# EAGLE design z80 (EAGLE 8.2.2)
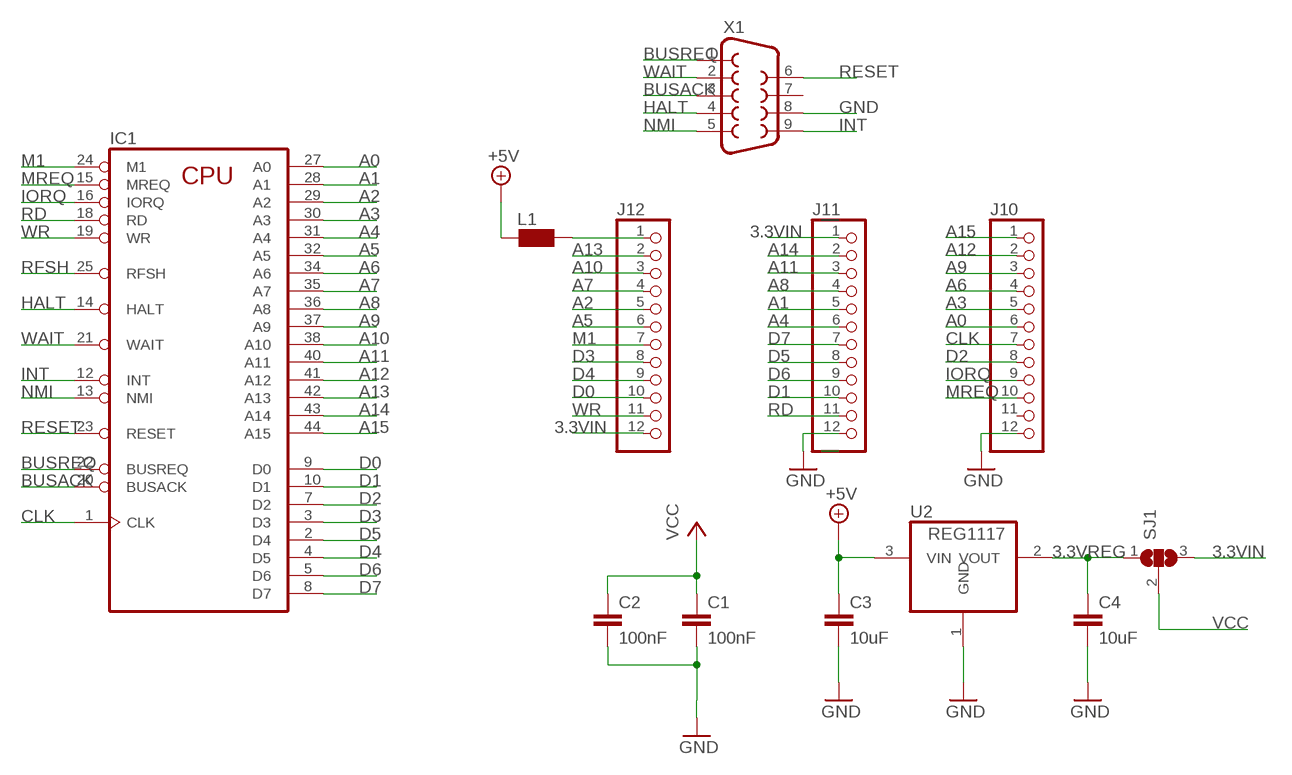
[diagram p0: schematic, sheet 1]

## Parts
C1  100nF  C-EUC0805K  [C0805K]
C2  100nF  C-EUC0805K  [C0805K]
C3  10uF  C-EUC0805K  [C0805K]
C4  10uF  C-EUC0805K  [C0805K]
IC1  Z80CPU-F  [QFP-44]
J10  PINHD-1X12  [1X12]
J11  PINHD-1X12  [1X12]
J12  PINHD-1X12  [1X12]
L1  WE-CBF_0805  [0805]
SJ1  SJ2W  [SJ_2]
U2  REG1117  [SOT223]
X1  F09D  [F09D]

## Nets
3.3VIN [power]: J11.1 J12.12 SJ1.3
3.3VREG [power]: C4.1 SJ1.1 U2.2(VOUT)
+5V [power]: C3.1 L1.2 U2.3(VIN)
A0: IC1.27(A0) J10.6
A1: IC1.28(A1) J11.5
A2: IC1.29(A2) J12.5
A3: IC1.30(A3) J10.5
A4: IC1.31(A4) J11.6
A5: IC1.32(A5) J12.6
A6: IC1.34(A6) J10.4
A7: IC1.35(A7) J12.4
A8: IC1.36(A8) J11.4
A9: IC1.37(A9) J10.3
A10: IC1.38(A10) J12.3
A11: IC1.40(A11) J11.3
A12: IC1.41(A12) J10.2
A13: IC1.42(A13) J12.2
A14: IC1.43(A14) J11.2
A15: IC1.44(A15) J10.1
BUSACK: IC1.20(BUSACK) X1.3
BUSREQ: IC1.22(BUSREQ) X1.1
CLK: IC1.1(CLK) J10.7
D0: IC1.9(D0) J12.10
D1: IC1.10(D1) J11.10
D2: IC1.7(D2) J10.8
D3: IC1.3(D3) J12.8
D4: IC1.4(D5) J12.9
D5: IC1.2(D4) J11.8
D6: IC1.5(D6) J11.9
D7: IC1.8(D7) J11.7
GND [power]: C1.2 C2.2 C3.2 C4.2 J10.12 J11.12 U2.1(GND) X1.8
HALT: IC1.14(HALT) X1.4
INT: IC1.12(INT) X1.9
IORQ: IC1.16(IORQ) J10.9
M1: IC1.24(M1) J12.7
MREQ: IC1.15(MREQ) J10.10
N$1 [power]: J12.1 L1.1
NMI: IC1.13(NMI) X1.5
RD: IC1.18(RD) J11.11
RESET: IC1.23(RESET) X1.6
RFSH: IC1.25(RFSH)
VCC [power]: C1.1 C2.1 SJ1.2
WAIT: IC1.21(WAIT) X1.2
WR: IC1.19(WR) J12.11
Unconnected: IC1.11(NC) IC1.17(NC) IC1.33(NC) IC1.39(NC) J10.11 X1.7

## Power pins joined to a net without a drawn wire
GND: IC1.26(GND)
VCC: IC1.6(VCC)

## Library data of the parts
C1-C4 = rcl:C-EU: CAPACITOR, European symbol
IC1 = Z80FAMIL:Z80CPU-F
J10-J12 = pinhead:PINHD-1X12: PIN HEADER
L1 = wuerth-elektronik:WE-CBF: SMD EMI Suppression Ferrite Beads - excellent anti-EMI properties - low DCR - impedances till 3000 ohms - rated current up to 6 A
SJ1 = jumper:SJ2W: SMD solder JUMPER
U2 = burr-brown:REG1117: 800mA and 1A Low Dropout (LDO) Positive Regulator 1.8V, 2.5V, 2.85V, 3.3V, 5V, and Adj
X1 = con-subd:F09: SUB-D; OC_FARNELL: unknown; OC_NEWARK: unknown

## Net classes
0 default: width 0.203 mm, clearance 0.203 mm
1 power: width 0.406 mm, clearance 0.203 mm to class 0, clearance 0.203 mm

## Board
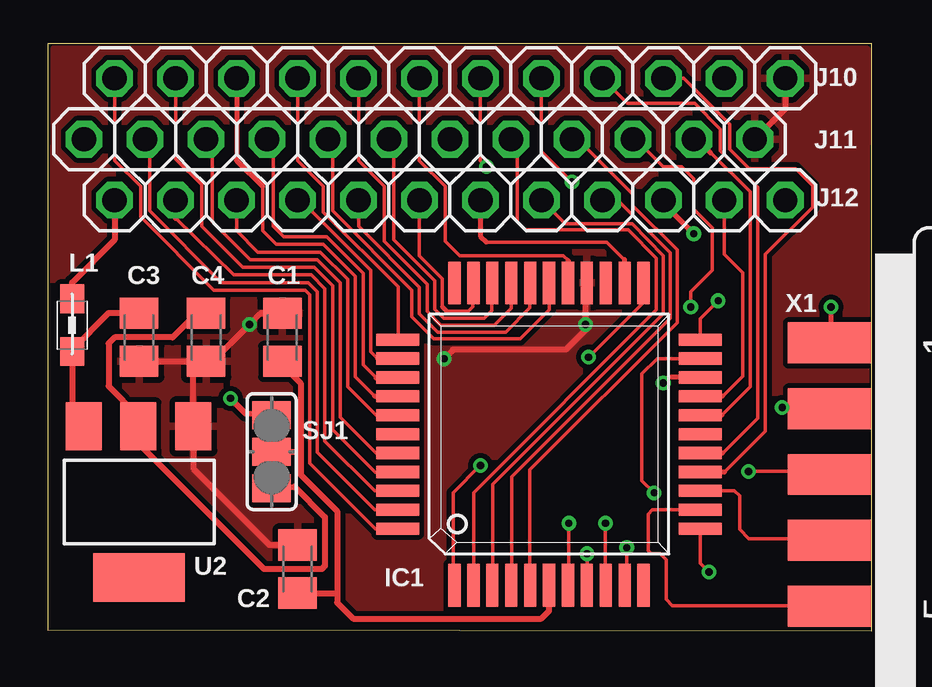
[diagram p1: board, top side]
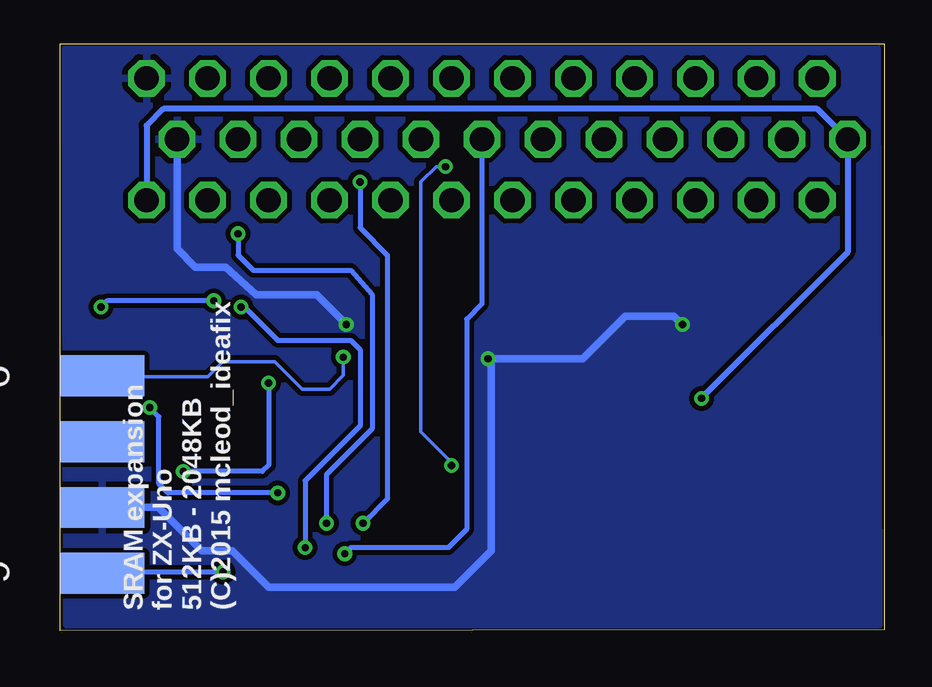
[diagram p2: board, bottom side, seen from below]

No outline drawn. Coordinates in mm, seen from the top.
Copper layers (1*16): Top 0.035mm / dielectric 1.5mm / Bottom 0.035mm
Design rules "dirt_cheap_dirty_boards.v1 *": minimum track width 6mil, minimum drill 12mil, track to track 6mil, track to pad 6mil, pad to pad 6mil, via to via 6mil, smd to smd 0mil, copper to edge 10mil, drill to drill 10mil, minimum pad ring 10mil, minimum via ring 6mil, stop-mask expansion 2mil, vias tented up to drill 25mil, thermal gap 10mil
Milling: 4 lines

### Footprints (pad centres in the part's own frame; a part is rotated, then mirrored left to right if it is on the bottom)
C0805K = smd 1.3 x 1.6: 1 -1,0; 2 1,0
QFP-44 = smd 0.508 x 1.778: 1 -3.937,-6.299; 2 -3.15,-6.299; 3 -2.362,-6.299; 4 -1.575,-6.299; 5 -0.787,-6.299; 6 0,-6.299; 7 0.787,-6.299; 8 1.575,-6.299; 9 2.362,-6.299; 10 3.15,-6.299; 11 3.937,-6.299; 23 3.937,6.299; 24 3.15,6.299; 25 2.362,6.299; 26 1.575,6.299; 27 0.787,6.299; 28 0,6.299; 29 -0.787,6.299; 30 -1.575,6.299; 31 -2.362,6.299; 32 -3.15,6.299; 33 -3.937,6.299 | smd 1.778 x 0.508: 12 6.299,-3.937; 13 6.299,-3.15; 14 6.299,-2.362; 15 6.299,-1.575; 16 6.299,-0.787; 17 6.299,0; 18 6.299,0.787; 19 6.299,1.575; 20 6.299,2.362; 21 6.299,3.15; 22 6.299,3.937; 34 -6.299,3.937; 35 -6.299,3.15; 36 -6.299,2.362; 37 -6.299,1.575; 38 -6.299,0.787; 39 -6.299,0; 40 -6.299,-0.787; 41 -6.299,-1.575; 42 -6.299,-2.362; 43 -6.299,-3.15; 44 -6.299,-3.937
1X12 = drill 1.016 octagon: 1 -13.97,0; 2 -11.43,0; 3 -8.89,0; 4 -6.35,0; 5 -3.81,0; 6 -1.27,0; 7 1.27,0; 8 3.81,0; 9 6.35,0; 10 8.89,0; 11 11.43,0; 12 13.97,0
0805 = smd 1.2 x 1: 1 -1.1,0; 2 1.1,0
SJ_2 = smd 1.168 x 1.6: 1 -1.524,0; 2 0,0; 3 1.524,0
SOT223 = smd 1.499 x 2.007: 1 -2.261,-3.15; 2 0.025,-3.15; 3 2.311,-3.15 | smd 3.81 x 2.007: 4 0,3.15
F09D = smd 1.7 x 3.5: 1 -5.486,-6.045; 2 -2.743,-6.045; 3 0,-6.045; 4 2.743,-6.045; 5 5.486,-6.045 | smd 1.7 x 3.5 bottom: 6 -4.115,-6.045; 7 -1.372,-6.045; 8 1.372,-6.045; 9 4.115,-6.045

### Placement (x,y rotation side)
C1  9.78,12.19 90 top
C2  10.41,2.54 90 top
C3  3.81,12.19 270 top
C4  6.6,12.19 270 top
IC1  20.89,8.16 0 top
J10  16.76,22.99 0 top
J11  15.49,20.45 0 top
J12  16.76,17.91 0 top
L1  1.02,12.7 270 top
SJ1  9.33,7.43 90 top
U2  3.81,5.33 180 top
X1  38.64,6.48 270 top

### Tracks (layer width: path | path; a pad name or v marks a point on that pad's centre or on a via)
3.3VIN  (via drill 0.3 pad 0.61)
  Top 0.254: SJ1.3 8.26,9.02 v7.62,9.65
  Bottom 0.254: J12.12 30.73,21.02 30.04,21.72 2.79,21.72 J11.1 1.52,15.75 v7.62,9.65
3.3VREG
  Top 0.254: C4.1 6.21,13.19 5.21,12.19 2.79,12.19 2.54,11.94 2.54,10.16 3.79,8.91 U2.2 3.81,8.46 3.81,7.75 9.02,2.54 11.43,2.54 11.56,2.67 11.56,4.7 10.29,5.97 SJ1.1
+5V
  Top 0.254: C3.1 3.79,13.21 2.54,13.21 1.02,11.68 L1.2 1.02,8.97 U2.3
A0
  Top 0.152: J10.6 15.49,19.56 16.57,18.48 16.57,16.19 17.18,15.59 21.5,15.59 21.68,15.4
  Top 0.203: 21.68,15.4 IC1.27
A1
  Top 0.152: 11.87,20.26 11.87,17.46 15.18,14.16 15.18,13.05 16.1,12.13 19.68,12.13 20.89,13.34 IC1.28
  Top 0.203: J11.5 11.87,20.26
A2
  Top 0.152: IC1.29 20.1,13.43 19.08,12.41 16.26,12.41 15.49,13.18 15.49,14.29 12.95,16.83 J12.5
  Top 0.203: IC1.29
A3
  Top 0.152: J10.5 12.95,19.56 14.03,18.48 14.03,16.19 15.81,14.41 15.81,13.27 16.38,12.7 18.61,12.7 19.32,13.41 IC1.30
A4
  Top 0.152: 14.41,20.26 14.41,16.26 16.13,14.54 16.13,13.37 16.51,12.99 18.19,12.99 18.51,13.3 18.51,14.44
  Top 0.203: J11.6 14.41,20.26 | 18.51,14.44 IC1.31
A5
  Top 0.152: J12.6 15.49,15.59 16.45,14.64 16.45,13.46 | 16.64,13.27 17.53,13.27 17.72,13.46 17.72,14.43
  Top 0.178: 16.45,13.46 16.64,13.27
  Top 0.203: 17.72,14.43 IC1.32
A6
  Top 0.152: J10.4 10.41,19.56 11.49,18.48 11.49,17.4 14.6,14.29 IC1.34
  Top 0.203: IC1.34
A7
  Top 0.152: 10.54,17.91 13.46,14.99 13.46,11.59 13.75,11.3
  Top 0.203: J12.4 10.54,17.91 | 13.75,11.3 IC1.35
A8
  Top 0.152: 9.4,20.26 9.4,16.83 9.84,16.38 11.62,16.38 13.14,14.86 13.14,11.05 13.68,10.51
  Top 0.203: J11.4 9.21,20.45 9.4,20.26 | 13.68,10.51 IC1.36
A9
  Top 0.152: 8.95,18.48 8.95,16.64 9.53,16.07 11.49,16.07 12.83,14.73 12.83,10.54 13.62,9.75
  Top 0.203: J10.3 7.87,19.56 8.95,18.48 | 13.62,9.75 14.58,9.75 IC1.37
A10
  Top 0.152: J12.3 7.87,16.64 8.76,15.75 11.37,15.75 12.51,14.61 12.51,10.13 13.68,8.95 IC1.38
  Top 0.203: IC1.38
A11
  Top 0.152: 6.86,20.19 6.86,17.02 8.45,15.43 11.24,15.43 12.19,14.48 12.19,8.86 13.68,7.37 IC1.40
  Top 0.203: J11.3 6.86,20.19 | IC1.40
A12
  Top 0.152: J10.2 5.33,19.62 6.41,18.54 6.41,16.83 8.13,15.11 11.11,15.11 11.87,14.35 11.87,8.35 13.65,6.57 IC1.41
  Top 0.203: IC1.41
A13
  Top 0.152: 5.33,17.14 7.75,14.8 10.99,14.8 11.56,14.22 11.56,7.87 13.62,5.81 IC1.42
  Top 0.203: J12.2 5.33,17.14 | IC1.42
A14
  Top 0.152: 4.25,20.19 4.25,17.46 7.24,14.48 10.86,14.48 11.24,14.1 11.24,7.4 13.63,5.01 IC1.43
  Top 0.203: J11.2 4.25,20.19
A15
  Top 0.152: J10.1 2.79,19.56 3.87,18.48 3.87,17.21 6.92,14.16 10.73,14.16 10.92,13.97 10.92,6.95 13.65,4.22 IC1.44
BUSACK  (via drill 0.3 pad 0.61)
  Top 0.152: v29.21,6.6 32.47,6.6
  Top 0.203: IC1.20 25.89,10.52 v25.65,10.29 | 32.47,6.6 X1.3
  Bottom 0.203: v25.65,10.29 25.65,6.86 25.91,6.6 v29.21,6.6
BUSREQ  (via drill 0.3 pad 0.61)
  Top 0.152: IC1.22 27.19,12.97 v27.94,13.72
  Top 0.203: v32.64,13.46 32.64,12.01 X1.1
  Bottom 0.203: v27.94,13.72 32.38,13.72 v32.64,13.46
CLK  (via drill 0.3 pad 0.61)
  Top 0.152: J10.7 18.03,19.56 v18.29,19.3 | v18.03,6.86 | IC1.1 16.89,1.92 16.89,5.71 v18.03,6.86
  Bottom 0.152: v18.29,19.3 18.67,19.3 19.3,18.67 19.3,8.26 18.16,7.11 18.16,6.99 v18.03,6.86
D0  (via drill 0.3 pad 0.61)
  Top 0.152: v23.24,4.45 23.24,1.87
  Top 0.203: J12.10 25.65,17.78 v26.92,16.51 | 23.24,1.87 IC1.9
  Bottom 0.203: v26.92,16.51 26.92,15.62 26.29,14.99 22.23,14.99 21.34,13.97 21.34,8.38 23.24,6.48 v23.24,4.45
D1  (via drill 0.3 pad 0.61)
  Top 0.152: 24.51,20.45 25.65,19.3 26.42,19.3 26.92,18.8 26.92,17.53 27.69,16.76 27.69,14.99 26.8,14.1 v26.8,13.46 | v24.13,3.43 24.13,1.95
  Top 0.203: J11.10 24.51,20.45 | 24.13,1.95 IC1.10
  Bottom 0.203: v26.8,13.46 26.67,13.46 25.27,12.06 22.23,12.06 21.84,11.68 21.84,8.51 24.13,6.22 v24.13,3.43
D2  (via drill 0.3 pad 0.61)
  Top 0.152: J10.8 20.57,19.94 v21.84,18.67 | v21.72,4.45 21.72,1.9
  Top 0.203: 21.72,1.9 IC1.7
  Bottom 0.203: v21.84,18.67 21.84,16.76 20.7,15.62 20.7,5.46 v21.72,4.45 21.46,4.7
D3
  Top 0.152: 18.54,1.87 18.54,6.06 25.65,13.18 25.65,15.59 24.35,16.92 21.56,16.92 J12.8
  Top 0.203: 18.54,1.87 IC1.3
D4
  Top 0.152: 23.75,17.91 25.94,15.72 25.94,12.99 19.34,6.38 19.34,1.88
  Top 0.203: J12.9 23.75,17.91 | 19.34,1.88 IC1.4
D5
  Top 0.152: 19.56,20.19 19.56,17.02 19.91,16.67 24.19,16.67 25.37,15.49 25.37,13.34 17.75,5.71 IC1.2
  Top 0.203: J11.8 19.56,20.19 | IC1.2
D6
  Top 0.152: 22.1,20.45 24.38,18.16 24.38,17.68 26.23,15.84 26.23,12.79 20.1,6.67 IC1.5
  Top 0.203: IC1.5 | J11.9 22.1,20.45
D7  (via drill 0.3 pad 0.61)
  Top 0.152: v22.48,3.17 22.48,1.87
  Top 0.203: 22.48,1.87 IC1.8
  Bottom 0.203: J11.7 16.76,13.59 17.4,12.95 17.4,4.19 18.16,3.43 22.23,3.43 v22.48,3.17
GND  (via drill 0.3 pad 0.61)
  Top 0.203: v22.42,12.73 22.42,12.51
  Top 0.254: C3.2 6.1,11.19 | 6.1,11.19 C4.2 6.87,11.19 v8.41,12.73 8.89,13.21 8.91,13.19 C1.2 | 6.1,11.19 6.07,11.17 U2.1 6.1,8.46 6.1,6.7 9.26,3.54 C2.2 | J10.12 30.73,21.72 J11.12 | v22.42,12.73 22.45,14.44 IC1.26 | 22.42,12.51 21.59,11.68 16.89,11.68 v16.51,11.3
  Bottom 0.203: 16.38,11.18 v16.51,11.3
  Bottom 0.305: J11.12 29.46,15.88 28.7,15.11 27.43,15.11 26.16,13.97 23.65,13.97 v22.42,12.73 22.45,12.76 | v16.51,11.3 12.57,11.3 10.79,13.08 8.76,13.08 v8.41,12.73 | X1.8 30.25,5.11 28.45,3.3 27.18,3.3 25.65,1.78 17.91,1.78 16.38,3.3 16.38,11.18
  pour Bottom: 0.29,24.23 34.13,24.19 34.07,0.22 0.22,0.22
  pour Top: 0.29,24.23 34.13,24.19 34.07,0.22 0.22,0.22
HALT
  Top 0.152: IC1.14 28.62,5.8 28.83,5.59 28.83,4.19 29.21,3.81 32.52,3.81
  Top 0.203: 32.52,3.81 X1.4
INT  (via drill 0.3 pad 0.61)
  Top 0.152: IC1.12 27.19,2.78 v27.56,2.41
  Bottom 0.203: v27.56,2.41 32.54,2.41 X1.9
IORQ
  Top 0.152: 28.13,7.37 29.59,8.83 29.59,18.45 28.04,19.97 28.04,20.86 26.96,21.94 24.16,21.94 J10.9
  Top 0.203: 28.13,7.37 IC1.16
M1
  Top 0.152: 18.29,16.16 23.3,16.16 24.04,15.43
  Top 0.203: J12.7 18.03,16.41 18.29,16.16 | 24.04,15.43 IC1.24
MREQ
  Top 0.152: 28.19,6.57 29.91,8.29 29.91,15.65 31.88,17.62 31.88,18.51 31.18,19.21 29.24,19.21 28.42,20.03 28.42,21.08 26.51,22.99 J10.10
  Top 0.203: 28.19,6.57 27.2,6.57 IC1.15
N$1
  Top 0.254: L1.1 1.02,14.48 2.79,16.26 J12.1
NMI
  Top 0.152: IC1.13 25.2,5.01 25.02,4.83 25.02,3.3 25.15,3.17 25.53,3.17 25.78,2.92 25.78,1.27 26.04,1.02 32.57,1.02
  Top 0.203: 32.57,1.02 X1.5
RD
  Top 0.152: 27.62,19.88 29.27,18.26 29.27,10.13 28.1,8.95
  Top 0.203: 28.1,8.95 IC1.18 | J11.11 27.05,20.45 27.62,19.88
RESET  (via drill 0.3 pad 0.61)
  Top 0.152: IC1.23 24.83,13.65 22.61,11.43 v22.54,11.37
  Bottom 0.152: v22.54,11.37 22.54,10.61 23.11,10.03 24.26,10.03 25.4,11.18 27.56,11.18 28.19,10.54 32.54,10.54 X1.6
VCC
  Top 0.254: C1.1 9.78,11.05 10.54,10.29 10.54,7.43 | 10.54,7.43 10.54,6.48 12.06,4.95 12.06,1.59 | SJ1.2 10.54,7.43 | 12.06,1.59 12.06,1.14 12.73,0.48 20.57,0.48 20.89,0.79 IC1.6 | C2.1 12.02,1.54 12.06,1.59
WAIT  (via drill 0.3 pad 0.61)
  Top 0.152: IC1.21 25.41,11.31 24.77,10.67 24.77,6.22 v25.27,5.71 | v30.61,9.27 32.54,9.27
  Top 0.203: 32.54,9.27 X1.2
  Bottom 0.203: v25.27,5.71 29.84,5.71 30.23,6.1 30.23,8.89 v30.61,9.27
WR
  Top 0.152: J12.11 28.19,15.65 28.96,14.89 28.96,10.57 28.13,9.75
  Top 0.203: 28.13,9.75 27.2,9.75 IC1.19

### Text on the board
bNames: SRAM expansion / for ZX-Uno / 512KB - 2048KB / (C)2015 mcleod_ideafix